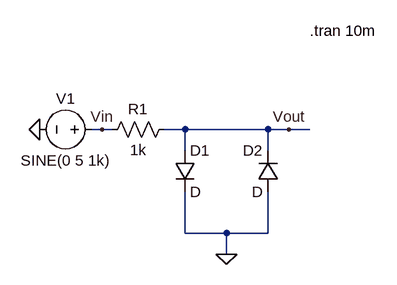
[diagram p0: schematic Limiteur.asc]
Limiteur.asc, the LTspice schematic file:
Version 4
SHEET 1 880 680
WIRE 32 128 16 128
WIRE 48 128 32 128
WIRE 160 128 128 128
WIRE 288 128 160 128
WIRE 320 128 288 128
WIRE 352 128 320 128
WIRE 160 160 160 128
WIRE 288 160 288 128
WIRE 160 288 160 224
WIRE 224 288 160 288
WIRE 288 288 288 224
WIRE 288 288 224 288
WIRE 224 320 224 288
FLAG 224 320 0
FLAG -64 128 0
FLAG 32 128 Vin
FLAG 320 128 Vout
SYMBOL res 144 112 R90
WINDOW 0 0 56 VBottom 2
WINDOW 3 32 56 VTop 2
SYMATTR InstName R1
SYMATTR Value 1k
SYMBOL diode 144 160 R0
SYMATTR InstName D1
SYMBOL diode 304 224 R180
WINDOW 0 24 64 Left 2
WINDOW 3 24 0 Left 2
SYMATTR InstName D2
SYMBOL voltage 32 128 R90
WINDOW 0 -32 56 VBottom 2
WINDOW 3 32 56 VTop 2
WINDOW 123 0 0 Left 0
WINDOW 39 0 0 Left 0
SYMATTR InstName V1
SYMATTR Value SINE(0 5 1k)
TEXT 352 -24 Left 2 !.tran 10m

The netlist it stands for:
* Limiteur.asc
R1 Vout Vin 1k
D1 Vout 0 D
D2 0 Vout D
V1 Vin 0 SINE(0 5 1k)
.model D D
.lib standard.dio
.tran 10m
.backanno
.end